# Altium schematic sheet Engine.SchDoc
size A3
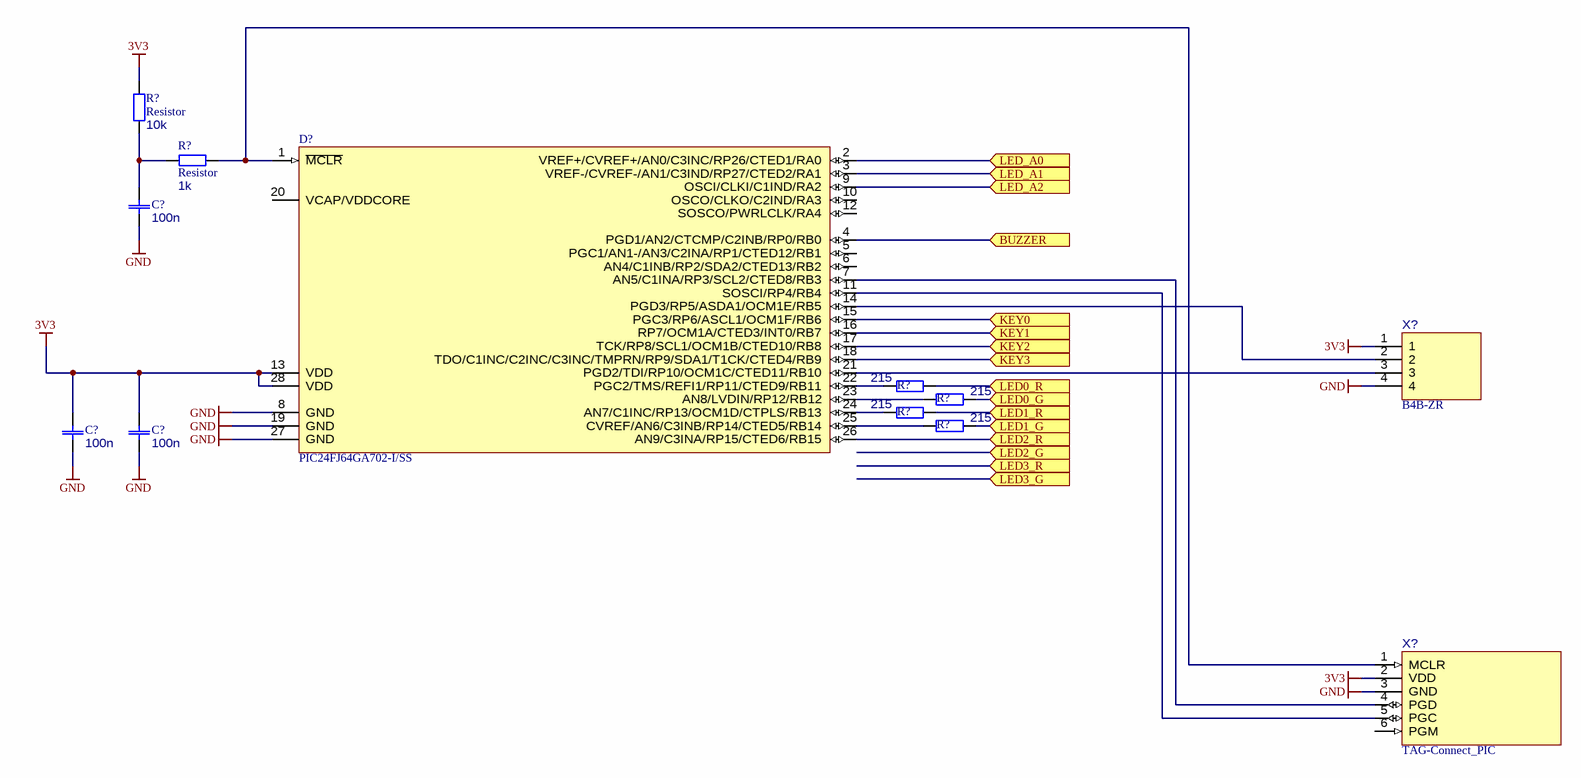
[diagram p0: Engine.SchDoc]

## Parts
(Parts that share a designator on the sheet are numbered #1, #2 ... from top to bottom, then left to right.)
C?#1  value 100n  [VISHAY_CAP_ 1608_0.9MM]  (hidden comment: Capacitor)
C?#2  value 100n  [VISHAY_CAP_ 1608_0.9MM]  (hidden comment: Capacitor)
C?#3  value 100n  [VISHAY_CAP_ 1608_0.9MM]  (hidden comment: Capacitor)
D?  PIC24FJ64GA702-I/SS  [MICROCHIP_SS28]
R?#1  Resistor  value 10k  [VISHAY_RES_ 1608_0.55MM]
R?#2  Resistor  value 1k  [VISHAY_RES_ 1608_0.55MM]
R?#3  value 215  [VISHAY_RES_ 1608_0.55MM]  (hidden comment: Resistor)
R?#4  value 215  [VISHAY_RES_ 1608_0.55MM]  (hidden comment: Resistor)
R?#5  value 215  [VISHAY_RES_ 1608_0.55MM]  (hidden comment: Resistor)
R?#6  value 215  [VISHAY_RES_ 1608_0.55MM]  (hidden comment: Resistor)
X?#1  B4B-ZR  [B4B-ZR]
X?#2  TAG-Connect_PIC  [(TAG-CONNECT)_TC2030-IDC-NL]

## Ports
BUZZER (in), KEY0 (in), KEY1 (in), KEY2 (in), KEY3 (in), LED0_G (in), LED0_R (in), LED1_G (in), LED1_R (in), LED2_G (in), LED2_R (in), LED3_G (in), LED3_R (in), LED_A0 (in), LED_A1 (in), LED_A2 (in)

## Nets
3V3: C?#2.2 C?#3.2 D?.13(VDD) D?.28(VDD) R?#1.2 X?#1.1 X?#2.2(VDD)
GND: C?#1.1 C?#2.1 C?#3.1 D?.8(GND) D?.19(GND) D?.27(GND) X?#1.4 X?#2.3(GND)
BUZZER: D?.4(PGD1/AN2/CTCMP/C2INB/RP0/RB0) ; port BUZZER
KEY0: D?.15(PGC3/RP6/ASCL1/OCM1F/RB6) ; port KEY0
KEY1: D?.16(RP7/OCM1A/CTED3/INT0/RB7) ; port KEY1
KEY2: D?.17(TCK/RP8/SCL1/OCM1B/CTED10/RB8) ; port KEY2
KEY3: D?.18(TDO/C1INC/C2INC/C3INC/TMPRN/RP9/SDA1/T1CK/CTED4/RB9) ; port KEY3
LED0_G: R?#4.2 ; port LED0_G
LED0_R: R?#3.2 ; port LED0_R
LED1_G: R?#6.2 ; port LED1_G
LED1_R: R?#5.2 ; port LED1_R
LED2_R: D?.26(AN9/C3INA/RP15/CTED6/RB15) ; port LED2_R
LED_A0: D?.2(VREF+/CVREF+/AN0/C3INC/RP26/CTED1/RA0) ; port LED_A0
LED_A1: D?.3(VREF-/CVREF-/AN1/C3IND/RP27/CTED2/RA1) ; port LED_A1
LED_A2: D?.9(OSCI/CLKI/C1IND/RA2) ; port LED_A2
NetC?#1_2: C?#1.2 R?#1.1 R?#2.1
NetD?_1: D?.1(~{MCLR}) R?#2.2 X?#2.1(MCLR)
NetD?_7: D?.7(AN5/C1INA/RP3/SCL2/CTED8/RB3) X?#2.4(PGD)
NetD?_11: D?.11(SOSCI/RP4/RB4) X?#2.5(PGC)
NetD?_14: D?.14(PGD3/RP5/ASDA1/OCM1E/RB5) X?#1.2
NetD?_21: D?.21(PGD2/TDI/RP10/OCM1C/CTED11/RB10) X?#1.3
NetD?_22: D?.22(PGC2/TMS/REFI1/RP11/CTED9/RB11) R?#3.1
NetD?_23: D?.23(AN8/LVDIN/RP12/RB12) R?#4.1
NetD?_24: D?.24(AN7/C1INC/RP13/OCM1D/CTPLS/RB13) R?#5.1
NetD?_25: D?.25(CVREF/AN6/C3INB/RP14/CTED5/RB14) R?#6.1

Not connected (* = marked no-connect by the designer): D? 5(PGC1/AN1-/AN3/C2INA/RP1/CTED12/RB1) 6(AN4/C1INB/RP2/SDA2/CTED13/RB2) 10(OSCO/CLKO/C2IND/RA3) 12(SOSCO/PWRLCLK/RA4) 20(VCAP/VDDCORE); X?#2 6(PGM)

## Notes on the sheet
- CONFIDENTIAL
- Copyright (C) 2017 Deciduous Development AB
- Title
- Drawn By
- Date
- Time
- Checked By
- Revision
- Document Number
- Page
- of
- All rights reserved. No part of this documentation may be reproduced without the written permission of Deciduous Development AB.

## Library data of the parts
C?#1-C?#3 = VJ0603Y104JXJCW1BC: Ceramic X7R 1608 100n 5% 16V; Manufacturer: Vishay; Capacitance: 1E-7; Voltage: 16; Published: 8-Jun-2000; LatestRevisionDate: 17-Jul-2002; LatestRevisionNote: Re-released for DXP Platform.; PackageReference: RAD-0.3; Publisher: Altium Limited; PackageDescription: Radial Cap, Thru-Hole; 2 Leads; 0.3 in Pin Spacing; Part Number: VJ0603Y104JXJCW1BC; Tolerance: 5%; Dielectricum: X7R; Package: 1608; Type: Ceramic
D? = PIC24FJ64GA702-I/SS: General purpose 16-bit Flash Microcontroller with nanoWatt XLP, 64KB Flash, 16KB SRAM, 28-Pin SSOP, Industrial Temperature; DatasheetVersion: revC, Aug-2010; PackageVersion: revBB, Aug-2009; PackageReference: SOIC-SO28; PackageDescription: 28-Lead Plastic Small Outline (SO) - Wide 7.50mm Body [SOIC]; Code_JEDEC: MS-013; ComponentLink1Description: Manufacturer URL; ComponentLink1URL: http://www.microchip.com/; ComponentLink2Description: Datasheet; ComponentLink2URL: http://ww1.microchip.com/downloads/en/DeviceDoc/39951C.pdf; ComponentLink3Description: Package Specification; ComponentLink3URL: http://www.microchip.com/stellent/groups/techpub_sg/documents/packagingspec/en012702.pdf
R?#1 = CRCW060310k0FKED: Metalfilm 0603 10kohm 0.1W; Manufactuer: Vishay; Resistance: 10000; Power: 0,1; Tolerance: 1%; Published: 8-Jun-2000; LatestRevisionDate: 17-Jul-2002; LatestRevisionNote: Re-released for DXP Platform.; PackageReference: AXIAL-0.4; Publisher: Altium Limited; PackageDescription: Axial Device, Thru-Hole; 2 Leads; 0.4 in Pin Spacing; Part Number: CRCW060310k0FKED; Package: 1608; Type: Metalfilm
R?#2 = CRCW06031k00FKED: Metalfilm 0603 1kohm 0.1W; Manufactuer: Vishay; Resistance: 1000; Power: 0,1; Tolerance: 1%; Published: 8-Jun-2000; LatestRevisionDate: 17-Jul-2002; LatestRevisionNote: Re-released for DXP Platform.; PackageReference: AXIAL-0.4; Publisher: Altium Limited; PackageDescription: Axial Device, Thru-Hole; 2 Leads; 0.4 in Pin Spacing; Part Number: CRCW06031k00FKED; Package: 1608; Type: Metalfilm
R?#3-R?#6 = CRCW0603215RFKED: Metalfilm 0603 215ohm 0.1W; Manufactuer: Vishay; Power: 0,1; Tolerance: 1%; Published: 8-Jun-2000; LatestRevisionDate: 17-Jul-2002; LatestRevisionNote: Re-released for DXP Platform.; PackageReference: AXIAL-0.4; Publisher: Altium Limited; PackageDescription: Axial Device, Thru-Hole; 2 Leads; 0.4 in Pin Spacing; Part Number: CRCW0603215RFKED; Resistance: 215; Package: 1608; Type: Metalfilm
X?#1 = B4B-ZR: JST ZH Connector, 4pin
X?#2 = TAG-Connect_PIC: Microchip PIC for TAG-Connect